# Altium schematic sheet STM32F411CEU6.SchDoc (part 1 of 3)
size A4
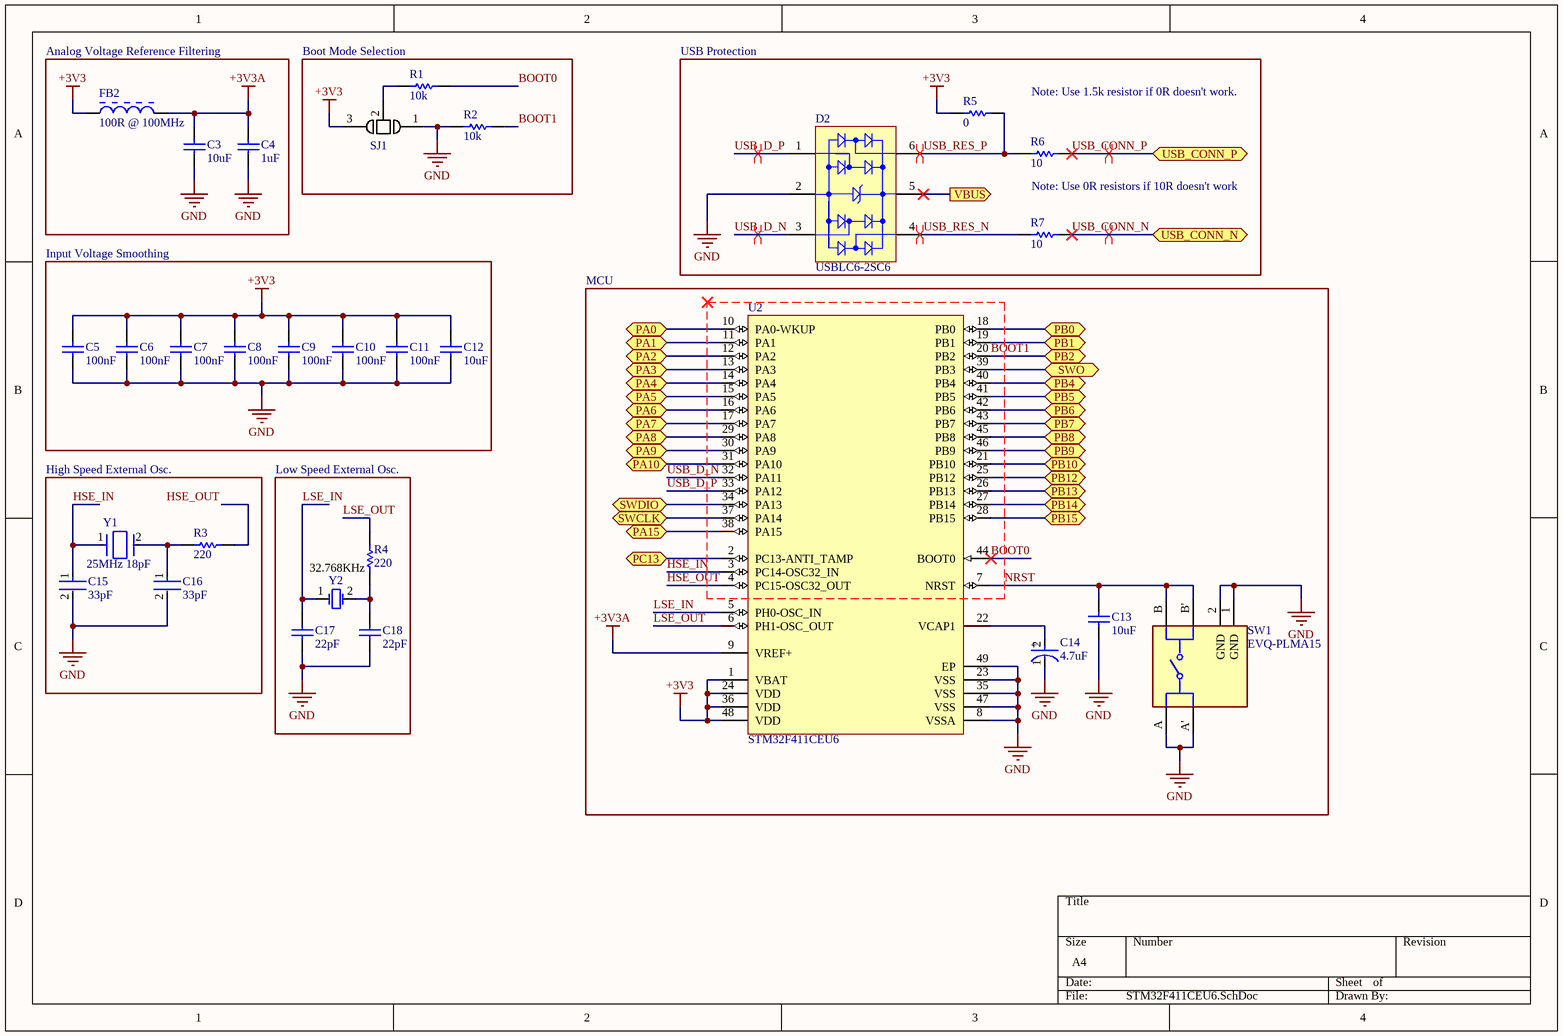
[diagram p0: STM32F411CEU6.SchDoc]

## Parts
C3  10uF  [CAPC3216X180X50LL20T30]
C4  1uF  [CAPC2013X140X50NL20T25]
C5  100nF  [CAPC2013X94X50LL20T25]
C6  100nF  [CAPC2013X94X50LL20T25]
C7  100nF  [CAPC2013X94X50LL20T25]
C8  100nF  [CAPC2013X94X50LL20T25]
C9  100nF  [CAPC2013X94X50LL20T25]
C10  100nF  [CAPC2013X94X50LL20T25]
C11  100nF  [CAPC2013X94X50LL20T25]
C12  10uF  [CAPC3216X180X50LL20T30]
C13  10uF  [CAPC3216X180X50LL20T30]
C14  4.7uF  [FP-F38M-MFG]
C15  33pF  [FP-CL790-IPC_C]
C16  33pF  [FP-CL790-IPC_C]
C17  22pF  [CAPC2012X88X50ML20T25]
C18  22pF  [CAPC2012X88X50ML20T25]
D2  USBLC6-2SC6  [STM-SOT23-6L_V]
FB2  100R @ 100MHz  [MURA-BLM18PG_KG-B25-CHIP-2_V1]
R1  10k  [RESC2013X70X40LL20T20]
R2  10k  [RESC2013X70X40LL20T20]
R3  220  [RESC2013X70X40NL20T20]
R4  220  [RESC2013X70X40NL20T20]
R5  0  [RESC2013X70X40NL20T20]
R6  10  [RESC2013X70X40LL20T20]
R7  10  [RESC2013X70X40LL20T20]
SJ1  Switchable Jumper  [6mil Switchable]  (value not drawn)
SW1  EVQ-PLMA15  [FP-EVQ-PLMA15-MFG]
U2  STM32F411CEU6  [STM-UFQFPN48_L]
Y1  25MHz 18pF  [FP-7A-MFG]
Y2  32.768KHz  [CMHT-CM315D-2_V]

## Blocks framed on the sheet
Analog Voltage Reference Filtering: C3 C4 FB2
Boot Mode Selection: R1 R2 SJ1
Input Voltage Smoothing: C5-C12
MCU: C13 C14 SW1 U2
High Speed External Osc.: C15 C16 R3 Y1
Low Speed External Osc.: C17 C18 R4 Y2

## Ports
PA0 (bidir), PA1 (bidir), PA2 (bidir), PA3 (bidir), PA4 (bidir), PA5 (bidir), PA6 (bidir), PA7 (bidir), PA8 (bidir), PA9 (bidir), PA10 (bidir), PA15 (bidir), PB0 (bidir), PB1 (bidir), PB2 (bidir), PB4 (bidir), PB5 (bidir), PB6 (bidir), PB7 (bidir), PB8 (bidir), PB9 (bidir), PB10 (bidir), PB12 (bidir), PB13 (bidir), PB14 (bidir), PB15 (bidir), PC13 (bidir), SWCLK (bidir), SWDIO (bidir), SWO (bidir), USB_CONN_N (bidir), USB_CONN_P (bidir), VBUS (out)

## Nets
+3V3: C5.2 C6.2 C7.2 C8.2 C9.2 C10.2 C11.2 C12.2 FB2.1 R5.2 SJ1.3 U2.1(VBAT) U2.24(VDD) U2.36(VDD) U2.48(VDD)
+3V3A: C3.2 C4.2 FB2.2 U2.9(VREF+)
GND: C3.1 C4.1 C5.1 C6.1 C7.1 C8.1 C9.1 C10.1 C11.1 C12.1 C13.1 C14.1(C) C15.2 C16.2 C17.1 C18.1 D2.2(GND) R2.1 SJ1.1 SW1.1(GND) SW1.2(GND) SW1.A SW1.A' U2.8(VSSA) U2.23(VSS) U2.35(VSS) U2.47(VSS) U2.49(EP)
BOOT0: R1.2 U2.44(BOOT0)
BOOT1: R2.2 U2.20(PB2) ; port PB2
HSE_IN: C15.1 U2.3(PC14-OSC32_IN) Y1.1
HSE_OUT: R3.2 U2.4(PC15-OSC32_OUT)
LSE_IN: C17.2 U2.5(PH0-OSC_IN) Y2.1
LSE_OUT: R4.2 U2.6(PH1-OSC_OUT)
NRST: C13.2 SW1.B SW1.B' U2.7(NRST)
PA0: U2.10(PA0-WKUP) ; port PA0
PA1: U2.11(PA1) ; port PA1
PA2: U2.12(PA2) ; port PA2
PA3: U2.13(PA3) ; port PA3
PA4: U2.14(PA4) ; port PA4
PA5: U2.15(PA5) ; port PA5
PA6: U2.16(PA6) ; port PA6
PA7: U2.17(PA7) ; port PA7
PA8: U2.29(PA8) ; port PA8
PA9: U2.30(PA9) ; port PA9
PA10: U2.31(PA10) ; port PA10
PA15: U2.38(PA15) ; port PA15
PB0: U2.18(PB0) ; port PB0
PB1: U2.19(PB1) ; port PB1
PB4: U2.40(PB4) ; port PB4
PB5: U2.41(PB5) ; port PB5
PB6: U2.42(PB6) ; port PB6
PB7: U2.43(PB7) ; port PB7
PB8: U2.45(PB8) ; port PB8
PB9: U2.46(PB9) ; port PB9
PB10: U2.21(PB10) ; port PB10
PB12: U2.25(PB12) ; port PB12
PB13: U2.26(PB13) ; port PB13
PB14: U2.27(PB14) ; port PB14
PB15: U2.28(PB15) ; port PB15
PC13: U2.2(PC13-ANTI_TAMP) ; port PC13
SWCLK: U2.37(PA14) ; port SWCLK
SWDIO: U2.34(PA13) ; port SWDIO
SWO: U2.39(PB3) ; port SWO
USB_CONN_N: R7.2 ; port USB_CONN_N
USB_CONN_P: R6.2 ; port USB_CONN_P
USB_D_N: D2.3(I/O_2) U2.32(PA11)
USB_D_P: D2.1(I/O_1) U2.33(PA12)
USB_RES_N: D2.4(I/O_3) R7.1
USB_RES_P: D2.6(I/O_4) R5.1 R6.1
VBUS: D2.5(VBUS) ; port VBUS
NetC14_2: C14.2(A) U2.22(VCAP1)
NetC16_1: C16.1 R3.1 Y1.2
NetC18_2: C18.2 R4.1 Y2.2
NetR1_1: R1.1 SJ1.2

## Layout directives
differential pair: USB_CONN_N, USB_CONN_P, USB_D_N, USB_D_P, USB_RES_N, USB_RES_P

## Notes on the sheet
- USB Protection
- Note: Use 1.5k resistor if 0R doesn't work.
- Note: Use 0R resistors if 10R doesn't work
- (in symbol CMP-04423-000002-1) +